# Altium schematic sheet [2] Block Diagram.SchDoc: ARS Camera REV01 Block Diagram
size A3; DrawnBy: Manh Ngo Van; Engineer: Manh Ngo Van; Organization: Altium Limited; Address1: L3, 12a Rodborough Rd; Address2: Frenchs Forest; Address3: NSW; Address4: Australia 2086; DocumentNumber: 2; Revision: 1.0; SheetNumber: 2; SheetTotal: 16
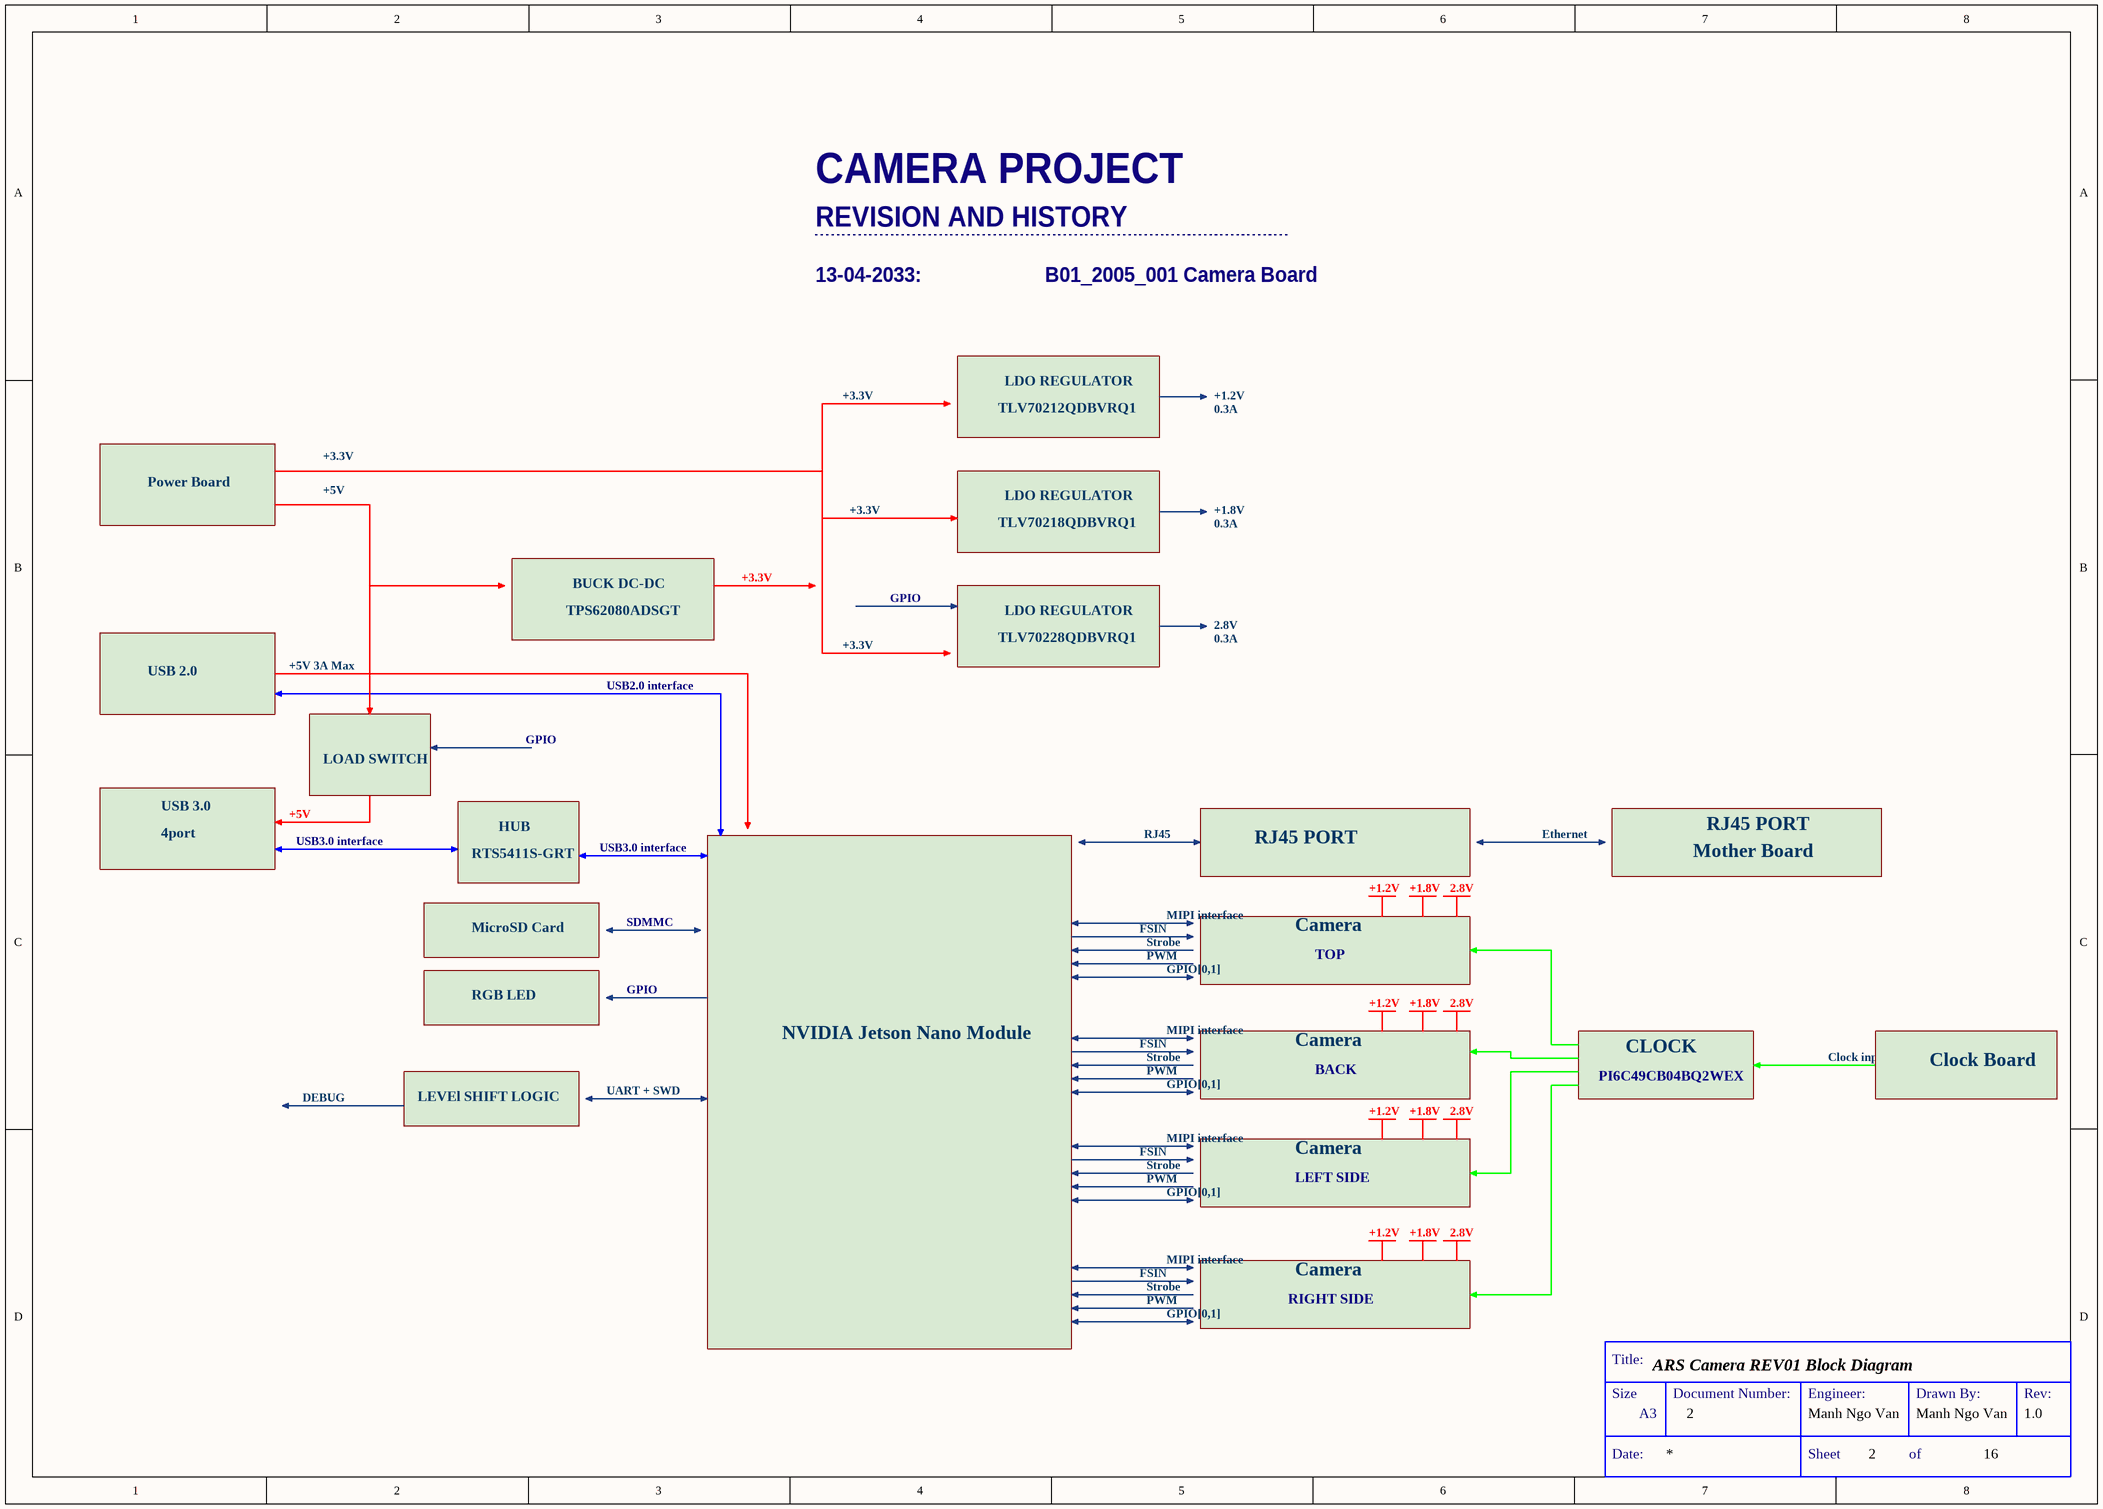
[diagram p0: [2] Block Diagram.SchDoc]

## Notes on the sheet
- CAMERA PROJECT
- REVISION AND HISTORY
- 13-04-2033:
- B01_2005_001 Camera Board
- +3.3V
- TLV70212QDBVRQ1
- LDO REGULATOR
- +1.2V
- 0.3A
- Power Board
- +5V
- +1.8V
- BUCK DC-DC
- TLV70218QDBVRQ1
- TPS62080ADSGT
- GPIO
- TLV70228QDBVRQ1
- 2.8V
- USB 2.0
- +5V 3A Max
- USB2.0 interface
- LOAD SWITCH
- USB 3.0
- 4port
- USB3.0 interface
- RTS5411S-GRT
- HUB
- RJ45
- RJ45 PORT
- Ethernet
- Mother Board
- MIPI interface
- MicroSD Card
- SDMMC
- FSIN
- Strobe
- PWM
- GPIO[0,1]
- Camera
- TOP
- RGB LED
- NVIDIA Jetson Nano Module
- CLOCK
- DEBUG
- LEVEl SHIFT LOGIC
- UART + SWD
- BACK
- PI6C49CB04BQ2WEX
- Clock input
- Clock Board
- LEFT SIDE
- RIGHT SIDE
- Title:
- Size
- Document Number:
- Engineer:
- Drawn By:
- Rev:
- Date:
- A3
- Sheet
- of